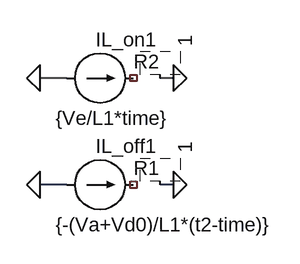
[diagram p0: schematic Draft2.asc]
Draft2.asc, the LTspice schematic file:
Version 4
SHEET 1 880 680
WIRE -176 16 -208 16
WIRE -48 16 -64 16
WIRE -176 144 -208 144
WIRE -48 144 -64 144
FLAG -208 144 0
FLAG -48 144 0
FLAG -208 16 0
FLAG -48 16 0
SYMBOL current -176 144 R270
WINDOW 0 46 35 VRight 2
WINDOW 3 -48 -13 VRight 2
WINDOW 123 0 0 Left 2
WINDOW 39 0 0 Left 2
SYMATTR InstName IL_off1
SYMATTR Value {-(Va+Vd0)/L1*(t2-time)}
SYMBOL MDB_sym\\isoR -80 144 R270
WINDOW 0 4 0 VTop 2
SYMATTR InstName R1
SYMATTR Value 1
SYMBOL current -176 16 R270
WINDOW 0 46 35 VRight 2
WINDOW 3 -48 -13 VRight 2
WINDOW 123 0 0 Left 2
WINDOW 39 0 0 Left 2
SYMATTR InstName IL_on1
SYMATTR Value {Ve/L1*time}
SYMBOL MDB_sym\\isoR -80 16 R270
WINDOW 0 4 0 VTop 2
SYMATTR InstName R2
SYMATTR Value 1

The netlist it stands for:
* Draft2.asc
IL_off1 0 NC_01 {-(Va+Vd0)/L1*(t2-time)}
* R1: 1 (symbol MDB_sym\isoR not available, pin order unknown); nets seen at it: 0
IL_on1 0 NC_02 {Ve/L1*time}
* R2: 1 (symbol MDB_sym\isoR not available, pin order unknown); nets seen at it: 0
.backanno
.end